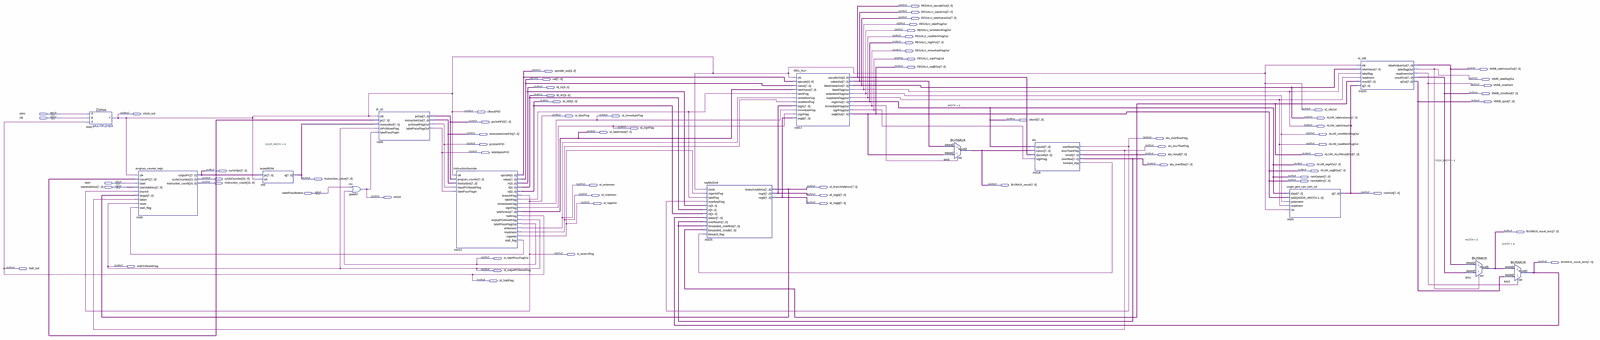
[diagram p0: schematic sheet, whole]
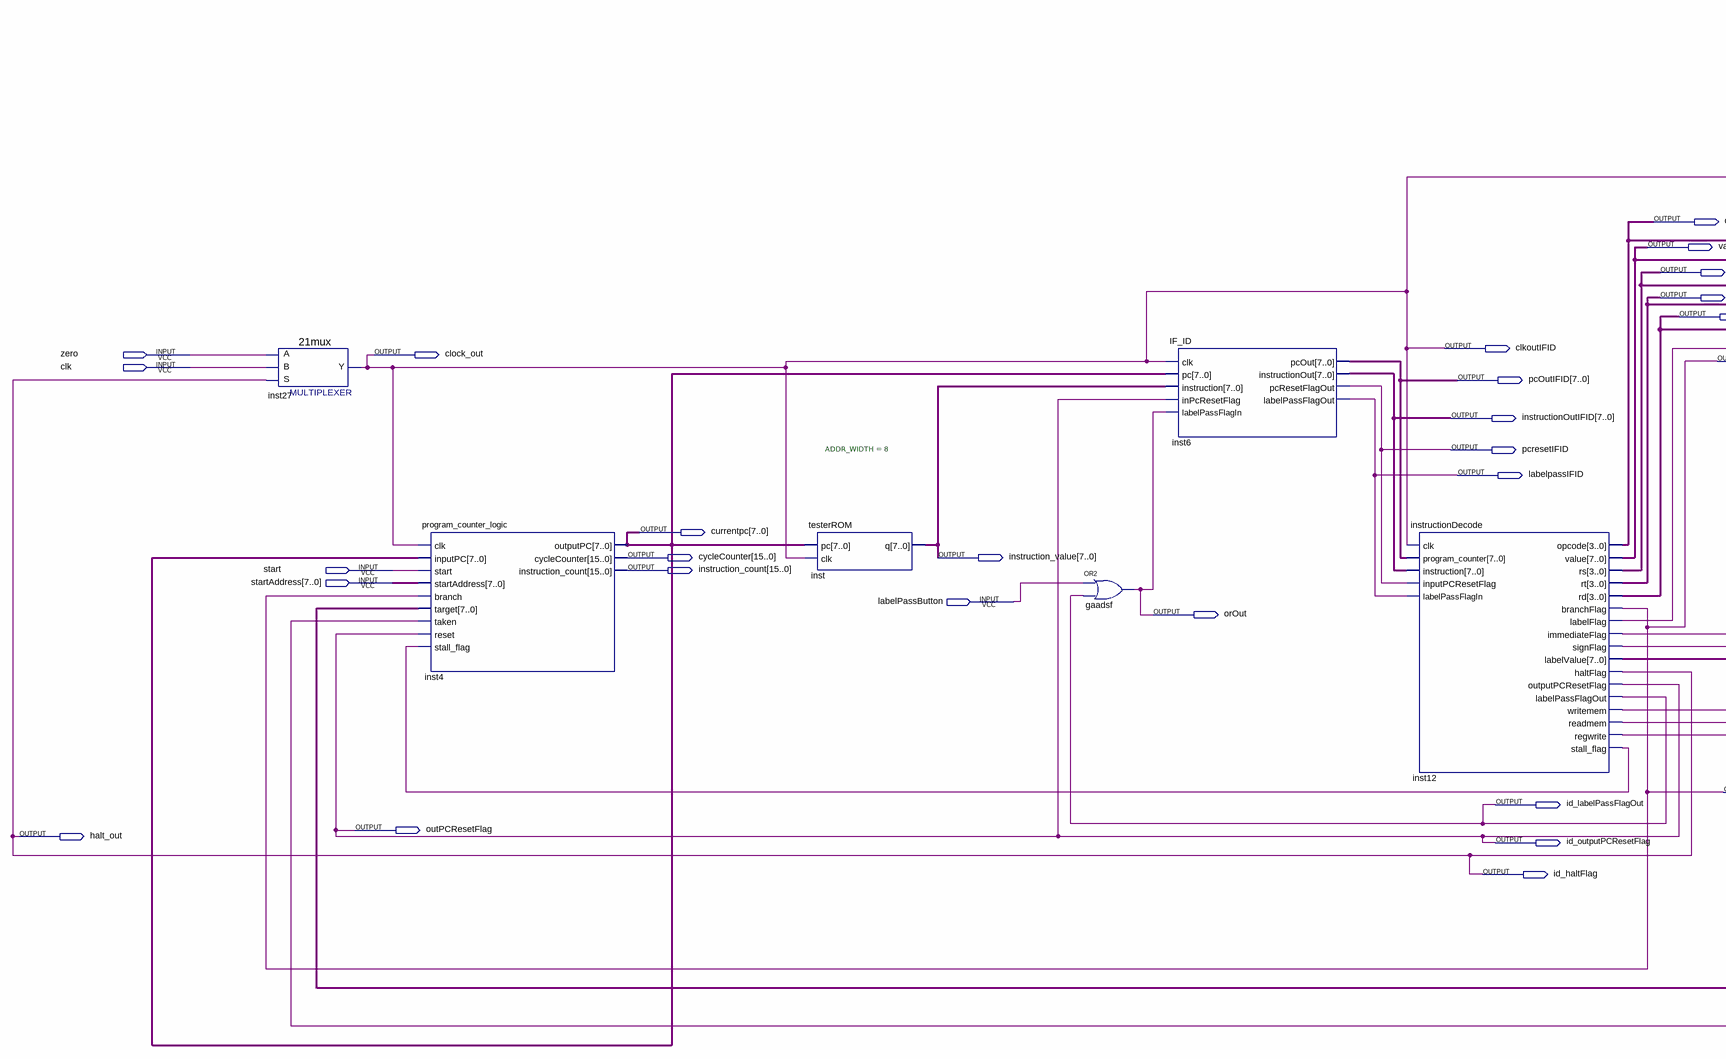
[diagram p1: schematic sheet, left part]
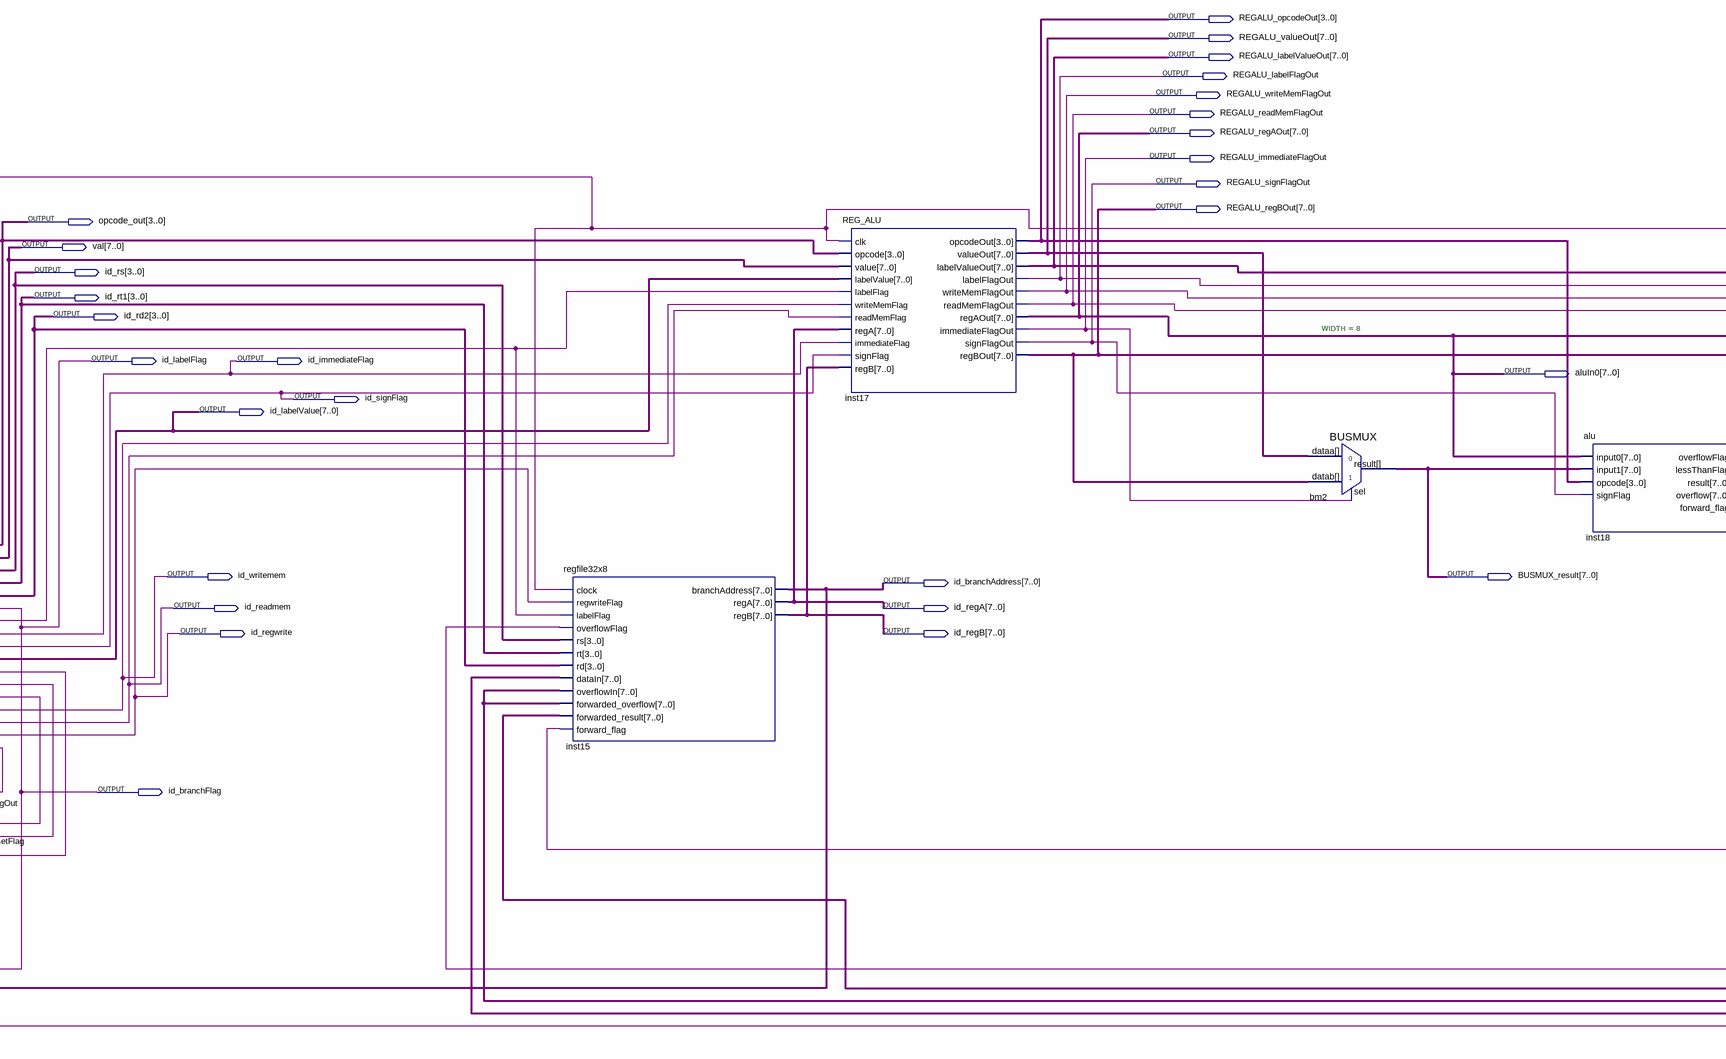
[diagram p2: schematic sheet, centre part]
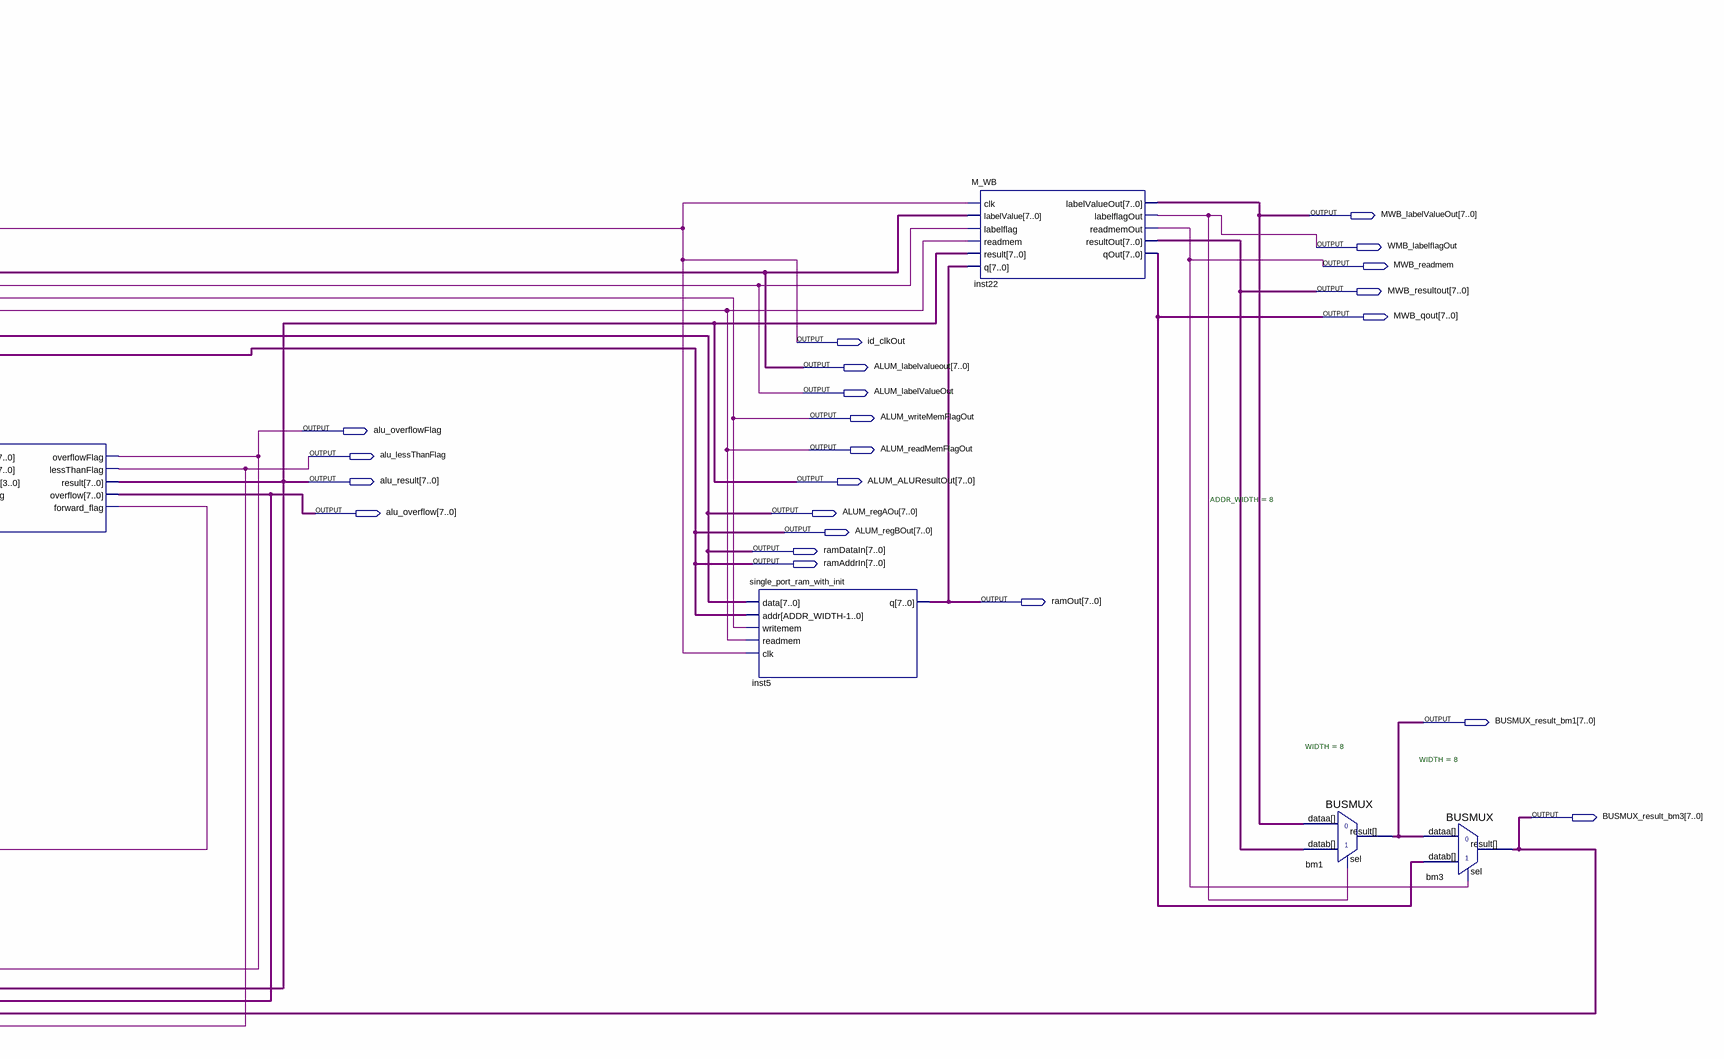
[diagram p3: schematic sheet, right part]
// Quartus schematic CS141L.bdf as structural Verilog: 14 symbols, 71 pins
module CS141L (
  input  zero,
  input  clk,
  input  start,
  input  [7:0] startAddress,
  input  labelPassButton,
  output [3:0] REGALU_opcodeOut,
  output [7:0] REGALU_valueOut,
  output [7:0] REGALU_labelValueOut,
  output REGALU_labelFlagOut,
  output REGALU_writeMemFlagOut,
  output REGALU_readMemFlagOut,
  output [7:0] REGALU_regAOut,
  output REGALU_immediateFlagOut,
  output REGALU_signFlagOut,
  output [7:0] REGALU_regBOut,
  output [7:0] MWB_labelValueOut,
  output [3:0] opcode_out,
  output [7:0] val,
  output WMB_labelflagOut,
  output MWB_readmem,
  output [3:0] id_rs,
  output [7:0] MWB_resultout,
  output [3:0] id_rt1,
  output [3:0] id_rd2,
  output [7:0] MWB_qout,
  output id_clkOut,
  output clkoutIFID,
  output clock_out,
  output id_labelFlag,
  output id_immediateFlag,
  output [7:0] ALUM_labelvalueout,
  output [7:0] aluIn0,
  output [7:0] pcOutIFID,
  output ALUM_labelvalueout_1bit,
  output id_signFlag,
  output [7:0] id_labelValue,
  output [7:0] instructionOutIFID,
  output ALUM_writeMemFlagOut,
  output alu_overflowFlag,
  output pcresetIFID,
  output ALUM_readMemFlagOut,
  output alu_lessThanFlag,
  output labelpassIFID,
  output [7:0] alu_result,
  output [7:0] ALUM_ALUResultOut,
  output [7:0] alu_overflow,
  output [7:0] ALUM_regAOu,
  output [7:0] currentpc,
  output [7:0] ALUM_regBOut,
  output [7:0] ramDataIn,
  output [15:0] cycleCounter,
  output [7:0] instruction_value,
  output [7:0] ramAddrIn,
  output [15:0] instruction_count,
  output id_writemem,
  output [7:0] BUSMUX_result,
  output [7:0] id_branchAddress,
  output [7:0] ramOut,
  output id_readmem,
  output [7:0] id_regA,
  output orOut,
  output id_regwrite,
  output [7:0] id_regB,
  output [7:0] BUSMUX_result_bm1,
  output id_branchFlag,
  output id_labelPassFlagOut,
  output [7:0] BUSMUX_result_bm3,
  output outPCResetFlag,
  output halt_out,
  output id_outputPCResetFlag,
  output id_haltFlag
);

  wire inst12_labelflag, inst12_stall_flag, inst18_forward_flag;

  \21mux  inst27 (.S(halt_out), .B(clk), .A(zero), .Y(clkoutIFID));
  program_counter_logic inst4 (
    .clk(clkoutIFID), .inputPC(currentpc), .start(start), .startAddress(startAddress),
    .branch(id_branchFlag), .target(id_branchAddress), .taken(alu_lessThanFlag),
    .reset(id_outputPCResetFlag), .stall_flag(inst12_stall_flag), .outputPC(currentpc),
    .cycleCounter(cycleCounter), .instruction_count(instruction_count));
  testerROM #(.ADDR_WIDTH(8)) inst (.pc(currentpc), .clk(clkoutIFID), .q(instruction_value));
  or gaadsf (orOut, labelPassButton, id_labelPassFlagOut);
  IF_ID inst6 (
    .clk(clkoutIFID), .pc(currentpc), .instruction(instruction_value), .inPcResetFlag(id_outputPCResetFlag),
    .labelPassFlagIn(orOut), .pcOut(pcOutIFID), .instructionOut(instructionOutIFID),
    .pcResetFlagOut(pcresetIFID), .labelPassFlagOut(labelpassIFID));
  instructionDecode inst12 (
    .clk(clkoutIFID), .program_counter(pcOutIFID), .instruction(instructionOutIFID),
    .inputPCResetFlag(pcresetIFID), .labelPassFlagIn(labelpassIFID), .opcode(opcode_out), .value(val),
    .rs(id_rs), .rt(id_rt1), .rd(id_rd2), .branchFlag(id_branchFlag), .labelFlag(inst12_labelflag),
    .immediateFlag(id_immediateFlag), .signFlag(id_signFlag), .labelValue(id_labelValue),
    .haltFlag(halt_out), .outputPCResetFlag(id_outputPCResetFlag), .labelPassFlagOut(id_labelPassFlagOut),
    .writemem(id_writemem), .readmem(id_readmem), .regwrite(id_regwrite), .stall_flag(inst12_stall_flag));
  regfile32x8 inst15 (
    .clock(clkoutIFID), .regwriteFlag(id_regwrite), .labelFlag(inst12_labelflag),
    .overflowFlag(alu_overflowFlag), .rs(id_rs), .rt(id_rt1), .rd(id_rd2), .dataIn(BUSMUX_result_bm3),
    .overflowIn(alu_overflow), .forwarded_overflow(alu_overflow), .forwarded_result(alu_result),
    .forward_flag(inst18_forward_flag), .branchAddress(id_branchAddress), .regA(id_regA), .regB(id_regB));
  REG_ALU inst17 (
    .clk(clkoutIFID), .opcode(opcode_out), .value(val), .labelValue(id_labelValue),
    .labelFlag(inst12_labelflag), .writeMemFlag(id_writemem), .readMemFlag(id_readmem), .regA(id_regA),
    .immediateFlag(id_immediateFlag), .signFlag(id_signFlag), .regB(id_regB), .opcodeOut(REGALU_opcodeOut),
    .valueOut(REGALU_valueOut), .labelValueOut(ALUM_labelvalueout), .labelFlagOut(ALUM_labelvalueout_1bit),
    .writeMemFlagOut(ALUM_writeMemFlagOut), .readMemFlagOut(ALUM_readMemFlagOut), .regAOut(aluIn0),
    .immediateFlagOut(REGALU_immediateFlagOut), .signFlagOut(REGALU_signFlagOut), .regBOut(ALUM_regBOut));
  BUSMUX #(.WIDTH(8)) bm2 (
    .datab(ALUM_regBOut), .sel(REGALU_immediateFlagOut), .dataa(REGALU_valueOut), .result(BUSMUX_result));
  alu inst18 (
    .input0(aluIn0), .input1(BUSMUX_result), .opcode(REGALU_opcodeOut), .signFlag(REGALU_signFlagOut),
    .overflowFlag(alu_overflowFlag), .lessThanFlag(alu_lessThanFlag), .result(alu_result),
    .overflow(alu_overflow), .forward_flag(inst18_forward_flag));
  single_port_ram_with_init #(.ADDR_WIDTH(8)) inst5 (
    .data(aluIn0), .addr(ALUM_regBOut), .writemem(ALUM_writeMemFlagOut), .readmem(ALUM_readMemFlagOut),
    .clk(clkoutIFID), .q(ramOut));
  M_WB inst22 (
    .clk(clkoutIFID), .labelValue(ALUM_labelvalueout), .labelflag(ALUM_labelvalueout_1bit),
    .readmem(ALUM_readMemFlagOut), .result(alu_result), .q(ramOut), .labelValueOut(MWB_labelValueOut),
    .labelflagOut(WMB_labelflagOut), .readmemOut(MWB_readmem), .resultOut(MWB_resultout), .qOut(MWB_qout));
  BUSMUX #(.WIDTH(8)) bm1 (
    .datab(MWB_resultout), .sel(WMB_labelflagOut), .dataa(MWB_labelValueOut), .result(BUSMUX_result_bm1));
  BUSMUX #(.WIDTH(8)) bm3 (.datab(MWB_qout), .sel(MWB_readmem), .dataa(BUSMUX_result_bm1), .result(BUSMUX_result_bm3));

  assign ALUM_ALUResultOut = alu_result;
  assign ALUM_regAOu = aluIn0;
  assign clock_out = clkoutIFID;
  assign id_clkOut = clkoutIFID;
  assign id_haltFlag = halt_out;
  assign id_labelFlag = id_branchFlag;
  assign outPCResetFlag = id_outputPCResetFlag;
  assign ramAddrIn = ALUM_regBOut;
  assign ramDataIn = aluIn0;
  assign REGALU_labelFlagOut = ALUM_labelvalueout_1bit;
  assign REGALU_labelValueOut = ALUM_labelvalueout;
  assign REGALU_readMemFlagOut = ALUM_readMemFlagOut;
  assign REGALU_regAOut = aluIn0;
  assign REGALU_regBOut = ALUM_regBOut;
  assign REGALU_writeMemFlagOut = ALUM_writeMemFlagOut;
endmodule
